# Altium schematic sheet Main.SchDoc
size A3 portrait
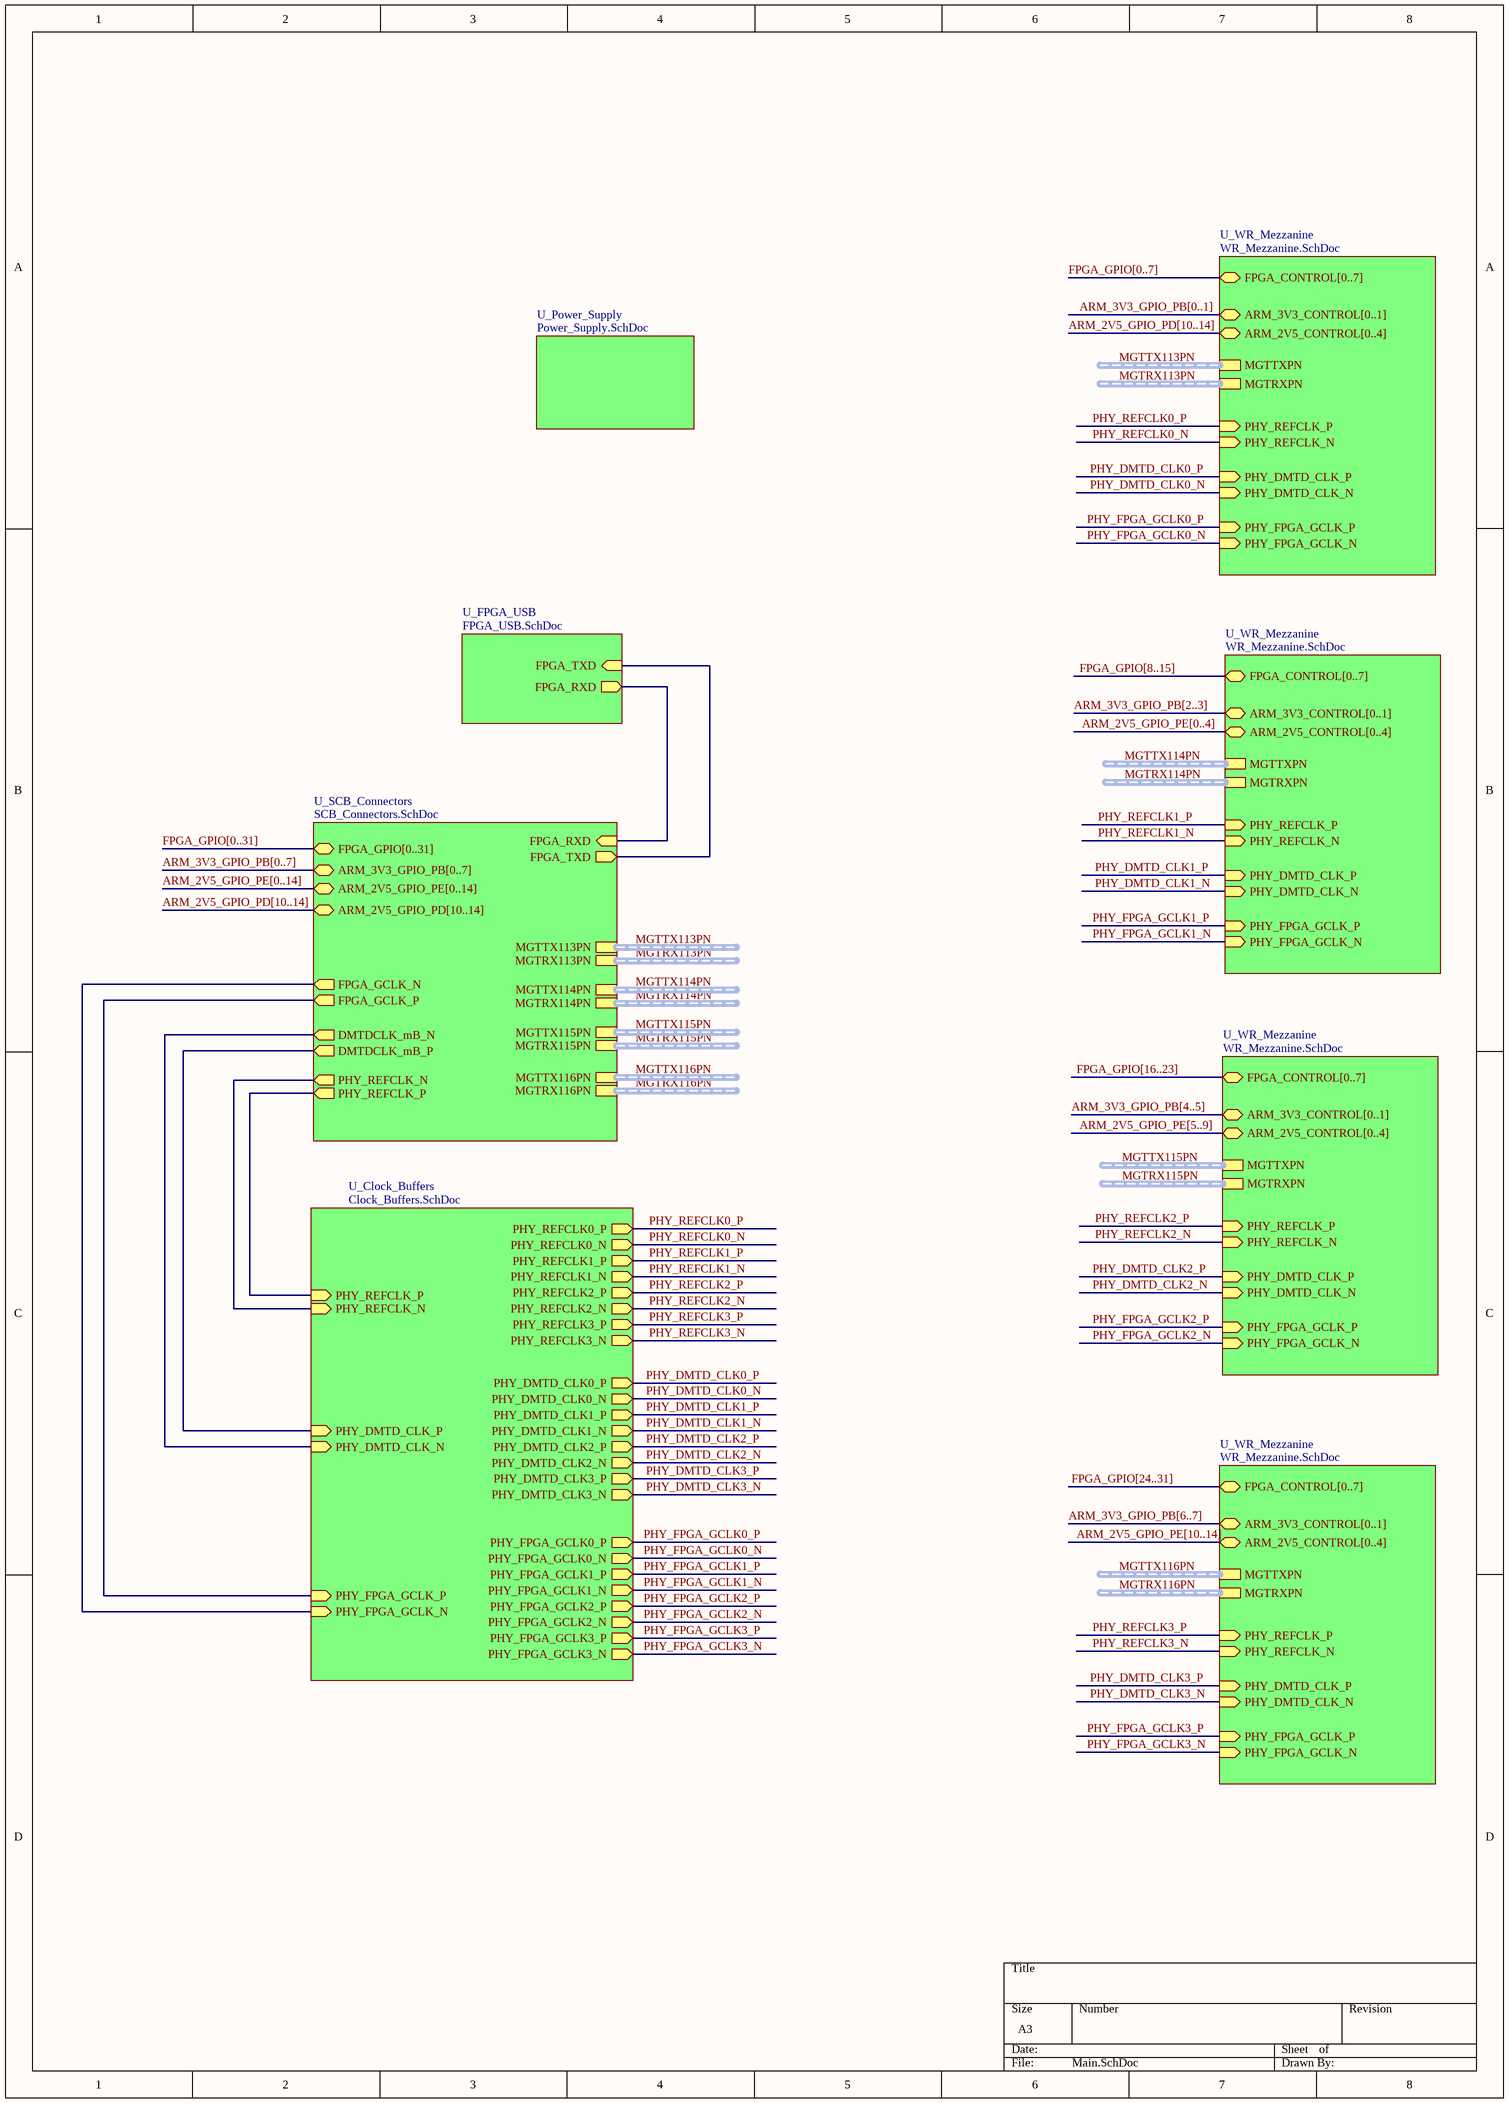
[diagram p0: Main.SchDoc]

## Sub-sheets
U_Clock_Buffers = Clock_Buffers.SchDoc: PHY_REFCLK_P (in), PHY_REFCLK_N (in), PHY_DMTD_CLK_P (in), PHY_DMTD_CLK_N (in), PHY_REFCLK0_P (out), PHY_REFCLK0_N (out), PHY_REFCLK1_P (out), PHY_REFCLK1_N (out), PHY_REFCLK2_P (out), PHY_REFCLK2_N (out), PHY_REFCLK3_P (out), PHY_REFCLK3_N (out), PHY_DMTD_CLK0_P (out), PHY_DMTD_CLK0_N (out), PHY_DMTD_CLK1_P (out), PHY_DMTD_CLK1_N (out), PHY_DMTD_CLK2_P (out), PHY_DMTD_CLK2_N (out), PHY_DMTD_CLK3_P (out), PHY_DMTD_CLK3_N (out), PHY_FPGA_GCLK_P (in), PHY_FPGA_GCLK_N (in), PHY_FPGA_GCLK0_P (out), PHY_FPGA_GCLK0_N (out), PHY_FPGA_GCLK1_P (out), PHY_FPGA_GCLK1_N (out), PHY_FPGA_GCLK2_P (out), PHY_FPGA_GCLK2_N (out), PHY_FPGA_GCLK3_P (out), PHY_FPGA_GCLK3_N (out)
U_FPGA_USB = FPGA_USB.SchDoc: FPGA_RXD (out), FPGA_TXD (in)
U_Power_Supply = Power_Supply.SchDoc: no entries
U_SCB_Connectors = SCB_Connectors.SchDoc: ARM_2V5_GPIO_PE[0..14] (bidir), FPGA_RXD (in), FPGA_TXD (out), ARM_2V5_GPIO_PD[10..14] (bidir), DMTDCLK_mB_P (out), DMTDCLK_mB_N (out), PHY_REFCLK_P (out), PHY_REFCLK_N (out), MGTRX113PN (harness MGTRX113PN), MGTRX114PN (harness MGTRX114PN), MGTRX115PN (harness MGTRX115PN), MGTRX116PN (harness MGTRX116PN), MGTTX113PN (harness MGTTX113PN), MGTTX114PN (harness MGTTX114PN), MGTTX115PN (harness MGTTX115PN), MGTTX116PN (harness MGTTX116PN), FPGA_GPIO[0..31] (bidir), ARM_3V3_GPIO_PB[0..7] (bidir), FPGA_GCLK_P (out), FPGA_GCLK_N (out)
U_WR_Mezzanine = WR_Mezzanine.SchDoc: FPGA_CONTROL[0..7] (bidir), ARM_3V3_CONTROL[0..1] (bidir), ARM_2V5_CONTROL[0..4] (bidir), MGTTXPN (harness MGTTXPN), MGTRXPN (harness MGTRXPN), PHY_REFCLK_P (in), PHY_REFCLK_N (in), PHY_DMTD_CLK_P (in), PHY_DMTD_CLK_N (in), PHY_FPGA_GCLK_P (in), PHY_FPGA_GCLK_N (in)
U_WR_Mezzanine = WR_Mezzanine.SchDoc: FPGA_CONTROL[0..7] (bidir), ARM_3V3_CONTROL[0..1] (bidir), ARM_2V5_CONTROL[0..4] (bidir), MGTTXPN (harness MGTTXPN), MGTRXPN (harness MGTRXPN), PHY_REFCLK_P (in), PHY_REFCLK_N (in), PHY_DMTD_CLK_P (in), PHY_DMTD_CLK_N (in), PHY_FPGA_GCLK_P (in), PHY_FPGA_GCLK_N (in)
U_WR_Mezzanine = WR_Mezzanine.SchDoc: FPGA_CONTROL[0..7] (bidir), ARM_3V3_CONTROL[0..1] (bidir), ARM_2V5_CONTROL[0..4] (bidir), MGTTXPN (harness MGTTXPN), MGTRXPN (harness MGTRXPN), PHY_REFCLK_P (in), PHY_REFCLK_N (in), PHY_DMTD_CLK_P (in), PHY_DMTD_CLK_N (in), PHY_FPGA_GCLK_P (in), PHY_FPGA_GCLK_N (in)
U_WR_Mezzanine = WR_Mezzanine.SchDoc: FPGA_CONTROL[0..7] (bidir), ARM_3V3_CONTROL[0..1] (bidir), ARM_2V5_CONTROL[0..4] (bidir), MGTTXPN (harness MGTTXPN), MGTRXPN (harness MGTRXPN), PHY_REFCLK_P (in), PHY_REFCLK_N (in), PHY_DMTD_CLK_P (in), PHY_DMTD_CLK_N (in), PHY_FPGA_GCLK_P (in), PHY_FPGA_GCLK_N (in)

## Nets
PHY_DMTD_CLK0_N: sheet U_Clock_Buffers/PHY_DMTD_CLK0_N, sheet U_WR_Mezzanine/PHY_DMTD_CLK_N
PHY_DMTD_CLK0_P: sheet U_Clock_Buffers/PHY_DMTD_CLK0_P, sheet U_WR_Mezzanine/PHY_DMTD_CLK_P
PHY_DMTD_CLK1_N: sheet U_Clock_Buffers/PHY_DMTD_CLK1_N, sheet U_WR_Mezzanine/PHY_DMTD_CLK_N
PHY_DMTD_CLK1_P: sheet U_Clock_Buffers/PHY_DMTD_CLK1_P, sheet U_WR_Mezzanine/PHY_DMTD_CLK_P
PHY_DMTD_CLK2_N: sheet U_Clock_Buffers/PHY_DMTD_CLK2_N, sheet U_WR_Mezzanine/PHY_DMTD_CLK_N
PHY_DMTD_CLK2_P: sheet U_Clock_Buffers/PHY_DMTD_CLK2_P, sheet U_WR_Mezzanine/PHY_DMTD_CLK_P
PHY_DMTD_CLK3_N: sheet U_Clock_Buffers/PHY_DMTD_CLK3_N, sheet U_WR_Mezzanine/PHY_DMTD_CLK_N
PHY_DMTD_CLK3_P: sheet U_Clock_Buffers/PHY_DMTD_CLK3_P, sheet U_WR_Mezzanine/PHY_DMTD_CLK_P
PHY_FPGA_GCLK0_N: sheet U_Clock_Buffers/PHY_FPGA_GCLK0_N, sheet U_WR_Mezzanine/PHY_FPGA_GCLK_N
PHY_FPGA_GCLK0_P: sheet U_Clock_Buffers/PHY_FPGA_GCLK0_P, sheet U_WR_Mezzanine/PHY_FPGA_GCLK_P
PHY_FPGA_GCLK1_N: sheet U_Clock_Buffers/PHY_FPGA_GCLK1_N, sheet U_WR_Mezzanine/PHY_FPGA_GCLK_N
PHY_FPGA_GCLK1_P: sheet U_Clock_Buffers/PHY_FPGA_GCLK1_P, sheet U_WR_Mezzanine/PHY_FPGA_GCLK_P
PHY_FPGA_GCLK2_N: sheet U_Clock_Buffers/PHY_FPGA_GCLK2_N, sheet U_WR_Mezzanine/PHY_FPGA_GCLK_N
PHY_FPGA_GCLK2_P: sheet U_Clock_Buffers/PHY_FPGA_GCLK2_P, sheet U_WR_Mezzanine/PHY_FPGA_GCLK_P
PHY_FPGA_GCLK3_N: sheet U_Clock_Buffers/PHY_FPGA_GCLK3_N, sheet U_WR_Mezzanine/PHY_FPGA_GCLK_N
PHY_FPGA_GCLK3_P: sheet U_Clock_Buffers/PHY_FPGA_GCLK3_P, sheet U_WR_Mezzanine/PHY_FPGA_GCLK_P
PHY_REFCLK0_N: sheet U_Clock_Buffers/PHY_REFCLK0_N, sheet U_WR_Mezzanine/PHY_REFCLK_N
PHY_REFCLK0_P: sheet U_Clock_Buffers/PHY_REFCLK0_P, sheet U_WR_Mezzanine/PHY_REFCLK_P
PHY_REFCLK1_N: sheet U_Clock_Buffers/PHY_REFCLK1_N, sheet U_WR_Mezzanine/PHY_REFCLK_N
PHY_REFCLK1_P: sheet U_Clock_Buffers/PHY_REFCLK1_P, sheet U_WR_Mezzanine/PHY_REFCLK_P
PHY_REFCLK2_N: sheet U_Clock_Buffers/PHY_REFCLK2_N, sheet U_WR_Mezzanine/PHY_REFCLK_N
PHY_REFCLK2_P: sheet U_Clock_Buffers/PHY_REFCLK2_P, sheet U_WR_Mezzanine/PHY_REFCLK_P
PHY_REFCLK3_N: sheet U_Clock_Buffers/PHY_REFCLK3_N, sheet U_WR_Mezzanine/PHY_REFCLK_N
PHY_REFCLK3_P: sheet U_Clock_Buffers/PHY_REFCLK3_P, sheet U_WR_Mezzanine/PHY_REFCLK_P
(unnamed): sheet U_FPGA_USB/FPGA_RXD, sheet U_SCB_Connectors/FPGA_RXD
(unnamed): sheet U_FPGA_USB/FPGA_TXD, sheet U_SCB_Connectors/FPGA_TXD
(unnamed): sheet U_Clock_Buffers/PHY_REFCLK_P, sheet U_SCB_Connectors/PHY_REFCLK_P
(unnamed): sheet U_Clock_Buffers/PHY_REFCLK_N, sheet U_SCB_Connectors/PHY_REFCLK_N
(unnamed): sheet U_Clock_Buffers/PHY_DMTD_CLK_P, sheet U_SCB_Connectors/DMTDCLK_mB_P
(unnamed): sheet U_Clock_Buffers/PHY_DMTD_CLK_N, sheet U_SCB_Connectors/DMTDCLK_mB_N
(unnamed): sheet U_Clock_Buffers/PHY_FPGA_GCLK_P, sheet U_SCB_Connectors/FPGA_GCLK_P
(unnamed): sheet U_Clock_Buffers/PHY_FPGA_GCLK_N, sheet U_SCB_Connectors/FPGA_GCLK_N

## Buses and harness runs
bus ARM_2V5_GPIO_PD[10..14] = sheet U_SCB_Connectors/ARM_2V5_GPIO_PD[10..14]
bus ARM_2V5_GPIO_PD[10..14] = sheet U_WR_Mezzanine/ARM_2V5_CONTROL[0..4]
bus ARM_2V5_GPIO_PE[0..4] = sheet U_WR_Mezzanine/ARM_2V5_CONTROL[0..4]
bus ARM_2V5_GPIO_PE[0..14] = sheet U_SCB_Connectors/ARM_2V5_GPIO_PE[0..14]
bus ARM_2V5_GPIO_PE[5..9] = sheet U_WR_Mezzanine/ARM_2V5_CONTROL[0..4]
bus ARM_2V5_GPIO_PE[10..14] = sheet U_WR_Mezzanine/ARM_2V5_CONTROL[0..4]
bus ARM_3V3_GPIO_PB[0..1] = sheet U_WR_Mezzanine/ARM_3V3_CONTROL[0..1]
bus ARM_3V3_GPIO_PB[0..7] = sheet U_SCB_Connectors/ARM_3V3_GPIO_PB[0..7]
bus ARM_3V3_GPIO_PB[2..3] = sheet U_WR_Mezzanine/ARM_3V3_CONTROL[0..1]
bus ARM_3V3_GPIO_PB[4..5] = sheet U_WR_Mezzanine/ARM_3V3_CONTROL[0..1]
bus ARM_3V3_GPIO_PB[6..7] = sheet U_WR_Mezzanine/ARM_3V3_CONTROL[0..1]
bus FPGA_GPIO[0..7] = sheet U_WR_Mezzanine/FPGA_CONTROL[0..7]
bus FPGA_GPIO[0..31] = sheet U_SCB_Connectors/FPGA_GPIO[0..31]
bus FPGA_GPIO[8..15] = sheet U_WR_Mezzanine/FPGA_CONTROL[0..7]
bus FPGA_GPIO[16..23] = sheet U_WR_Mezzanine/FPGA_CONTROL[0..7]
bus FPGA_GPIO[24..31] = sheet U_WR_Mezzanine/FPGA_CONTROL[0..7]
harness MGTRX113PN = sheet U_SCB_Connectors/MGTRX113PN
harness MGTRX113PN = sheet U_WR_Mezzanine/MGTRXPN
harness MGTRX114PN = sheet U_SCB_Connectors/MGTRX114PN
harness MGTRX114PN = sheet U_WR_Mezzanine/MGTRXPN
harness MGTRX115PN = sheet U_SCB_Connectors/MGTRX115PN
harness MGTRX115PN = sheet U_WR_Mezzanine/MGTRXPN
harness MGTRX116PN = sheet U_SCB_Connectors/MGTRX116PN
harness MGTRX116PN = sheet U_WR_Mezzanine/MGTRXPN
harness MGTTX113PN = sheet U_SCB_Connectors/MGTTX113PN
harness MGTTX113PN = sheet U_WR_Mezzanine/MGTTXPN
harness MGTTX114PN = sheet U_SCB_Connectors/MGTTX114PN
harness MGTTX114PN = sheet U_WR_Mezzanine/MGTTXPN
harness MGTTX115PN = sheet U_SCB_Connectors/MGTTX115PN
harness MGTTX115PN = sheet U_WR_Mezzanine/MGTTXPN
harness MGTTX116PN = sheet U_SCB_Connectors/MGTTX116PN
harness MGTTX116PN = sheet U_WR_Mezzanine/MGTTXPN